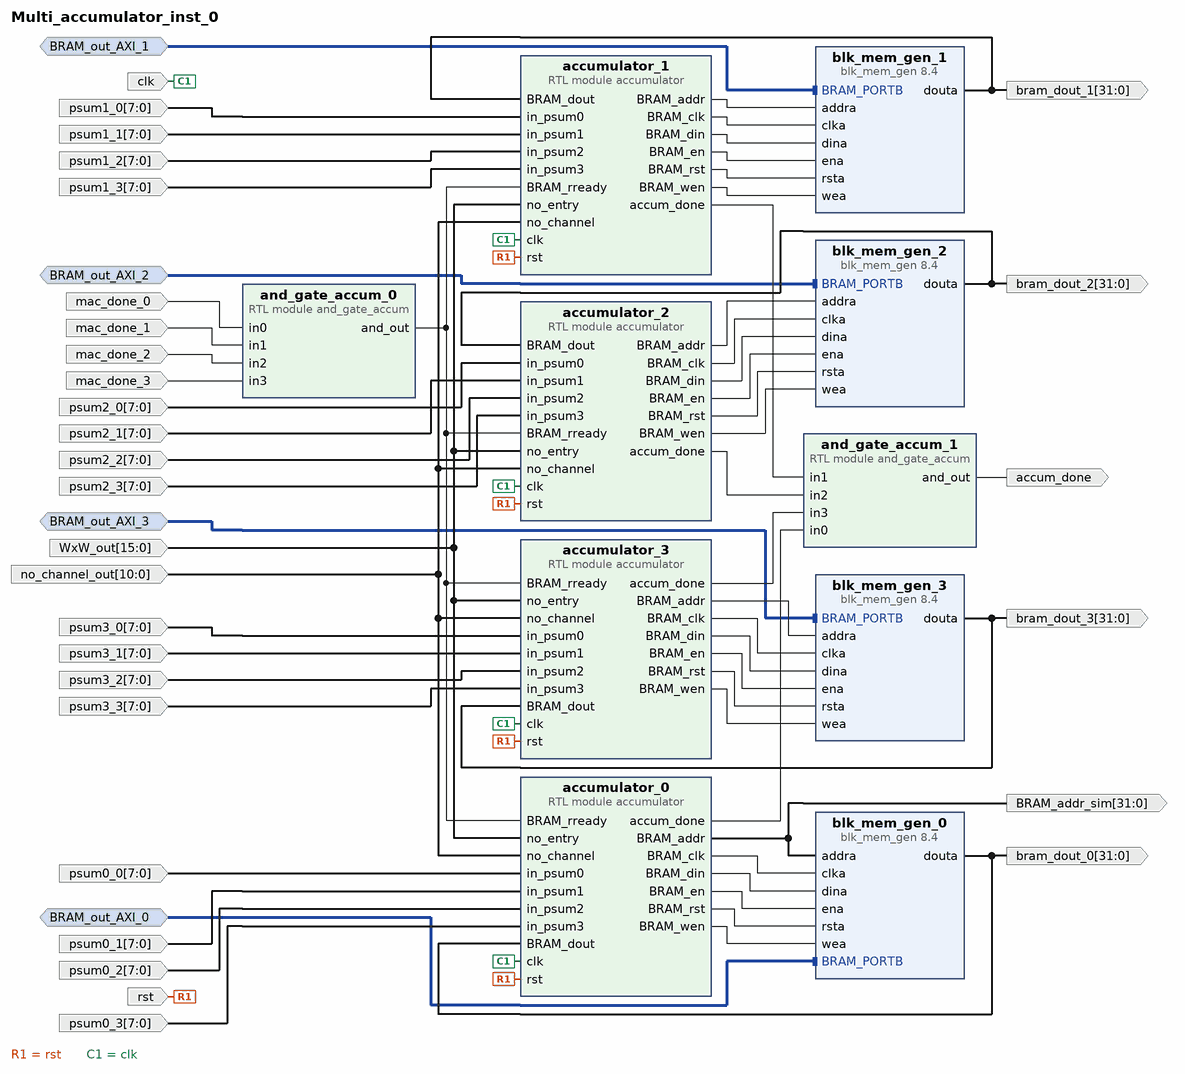
[diagram p0: block diagram of the top level]
# Vivado block design Multi_accumulator_inst_0, xc7z020clg400-1, Vivado 2021.1
create_bd_design Multi_accumulator_inst_0

create_bd_intf_port -mode Slave -vlnv xilinx.com:interface:bram_rtl:1.0 BRAM_out_AXI_0
create_bd_intf_port -mode Slave -vlnv xilinx.com:interface:bram_rtl:1.0 BRAM_out_AXI_1
create_bd_intf_port -mode Slave -vlnv xilinx.com:interface:bram_rtl:1.0 BRAM_out_AXI_2
create_bd_intf_port -mode Slave -vlnv xilinx.com:interface:bram_rtl:1.0 BRAM_out_AXI_3
create_bd_port -dir I -type clk clk
create_bd_port -dir I -from 7 -to 0 psum0_0
create_bd_port -dir I -from 7 -to 0 psum0_1
create_bd_port -dir I -from 7 -to 0 psum0_2
create_bd_port -dir I -from 7 -to 0 psum0_3
create_bd_port -dir I -from 7 -to 0 psum1_0
create_bd_port -dir I -from 7 -to 0 psum1_1
create_bd_port -dir I -from 7 -to 0 psum1_2
create_bd_port -dir I -from 7 -to 0 psum1_3
create_bd_port -dir I -from 7 -to 0 psum2_0
create_bd_port -dir I -from 7 -to 0 psum2_1
create_bd_port -dir I -from 7 -to 0 psum2_2
create_bd_port -dir I -from 7 -to 0 psum2_3
create_bd_port -dir I -from 7 -to 0 psum3_0
create_bd_port -dir I -from 7 -to 0 psum3_1
create_bd_port -dir I -from 7 -to 0 psum3_2
create_bd_port -dir I -from 7 -to 0 psum3_3
create_bd_port -dir I rst
create_bd_port -dir I mac_done_0
create_bd_port -dir I mac_done_1
create_bd_port -dir I mac_done_2
create_bd_port -dir I mac_done_3
create_bd_port -dir O accum_done
create_bd_port -dir I -from 15 -to 0 WxW_out
create_bd_port -dir I -from 10 -to 0 no_channel_out
create_bd_port -dir O -from 31 -to 0 bram_dout_0
create_bd_port -dir O -from 31 -to 0 bram_dout_1
create_bd_port -dir O -from 31 -to 0 bram_dout_2
create_bd_port -dir O -from 31 -to 0 bram_dout_3
create_bd_port -dir O -from 31 -to 0 BRAM_addr_sim

create_bd_cell -type ip -vlnv xilinx.com:ip:blk_mem_gen:8.4 blk_mem_gen_0
set_property -dict [list \
  CONFIG.Assume_Synchronous_Clk true \
  CONFIG.EN_SAFETY_CKT false \
  CONFIG.Enable_B Use_ENB_Pin \
  CONFIG.Memory_Type True_Dual_Port_RAM \
  CONFIG.Port_B_Clock 100 \
  CONFIG.Port_B_Enable_Rate 100 \
  CONFIG.Port_B_Write_Rate 50 \
  CONFIG.Use_RSTB_Pin true \
] [get_bd_cells blk_mem_gen_0]
create_bd_cell -type ip -vlnv xilinx.com:ip:blk_mem_gen:8.4 blk_mem_gen_2
set_property -dict [list \
  CONFIG.Assume_Synchronous_Clk true \
  CONFIG.EN_SAFETY_CKT false \
  CONFIG.Enable_B Use_ENB_Pin \
  CONFIG.Memory_Type True_Dual_Port_RAM \
  CONFIG.Port_B_Clock 100 \
  CONFIG.Port_B_Enable_Rate 100 \
  CONFIG.Port_B_Write_Rate 50 \
  CONFIG.Use_RSTB_Pin true \
] [get_bd_cells blk_mem_gen_2]
create_bd_cell -type ip -vlnv xilinx.com:ip:blk_mem_gen:8.4 blk_mem_gen_3
set_property -dict [list \
  CONFIG.Assume_Synchronous_Clk true \
  CONFIG.EN_SAFETY_CKT false \
  CONFIG.Enable_B Use_ENB_Pin \
  CONFIG.Memory_Type True_Dual_Port_RAM \
  CONFIG.Port_B_Clock 100 \
  CONFIG.Port_B_Enable_Rate 100 \
  CONFIG.Port_B_Write_Rate 50 \
  CONFIG.Use_RSTB_Pin true \
] [get_bd_cells blk_mem_gen_3]
create_bd_cell -type ip -vlnv xilinx.com:ip:blk_mem_gen:8.4 blk_mem_gen_1
set_property -dict [list \
  CONFIG.Assume_Synchronous_Clk true \
  CONFIG.EN_SAFETY_CKT false \
  CONFIG.Enable_B Use_ENB_Pin \
  CONFIG.Memory_Type True_Dual_Port_RAM \
  CONFIG.Port_B_Clock 100 \
  CONFIG.Port_B_Enable_Rate 100 \
  CONFIG.Port_B_Write_Rate 50 \
  CONFIG.Use_RSTB_Pin true \
] [get_bd_cells blk_mem_gen_1]
create_bd_cell -type module -reference and_gate_accum and_gate_accum_0
create_bd_cell -type module -reference and_gate_accum and_gate_accum_1
create_bd_cell -type module -reference accumulator accumulator_0
create_bd_cell -type module -reference accumulator accumulator_2
create_bd_cell -type module -reference accumulator accumulator_1
create_bd_cell -type module -reference accumulator accumulator_3

# ---- connections ----

connect_bd_intf_net -intf_net BRAM_PORTB_0_1 [get_bd_intf_ports BRAM_out_AXI_0] [get_bd_intf_pins blk_mem_gen_0/BRAM_PORTB]
connect_bd_intf_net -intf_net BRAM_PORTB_1_1 [get_bd_intf_ports BRAM_out_AXI_1] [get_bd_intf_pins blk_mem_gen_1/BRAM_PORTB]
connect_bd_intf_net -intf_net BRAM_PORTB_2_1 [get_bd_intf_ports BRAM_out_AXI_2] [get_bd_intf_pins blk_mem_gen_2/BRAM_PORTB]
connect_bd_intf_net -intf_net BRAM_PORTB_3_1 [get_bd_intf_ports BRAM_out_AXI_3] [get_bd_intf_pins blk_mem_gen_3/BRAM_PORTB]
connect_bd_net [get_bd_ports rst] \
  [get_bd_pins accumulator_0/rst] [get_bd_pins accumulator_2/rst] [get_bd_pins accumulator_1/rst] \
  [get_bd_pins accumulator_3/rst]
connect_bd_net [get_bd_ports WxW_out] \
  [get_bd_pins accumulator_0/no_entry] [get_bd_pins accumulator_2/no_entry] [get_bd_pins accumulator_1/no_entry] \
  [get_bd_pins accumulator_3/no_entry]
connect_bd_net [get_bd_ports no_channel_out] \
  [get_bd_pins accumulator_0/no_channel] [get_bd_pins accumulator_2/no_channel] [get_bd_pins accumulator_1/no_channel] \
  [get_bd_pins accumulator_3/no_channel]
connect_bd_net [get_bd_pins accumulator_0/BRAM_addr] [get_bd_pins blk_mem_gen_0/addra] [get_bd_ports BRAM_addr_sim]
connect_bd_net [get_bd_pins accumulator_0/BRAM_clk] [get_bd_pins blk_mem_gen_0/clka]
connect_bd_net [get_bd_pins accumulator_0/BRAM_din] [get_bd_pins blk_mem_gen_0/dina]
connect_bd_net [get_bd_pins accumulator_0/BRAM_en] [get_bd_pins blk_mem_gen_0/ena]
connect_bd_net [get_bd_pins accumulator_0/BRAM_rst] [get_bd_pins blk_mem_gen_0/rsta]
connect_bd_net [get_bd_pins accumulator_0/BRAM_wen] [get_bd_pins blk_mem_gen_0/wea]
connect_bd_net [get_bd_pins accumulator_0/accum_done] [get_bd_pins and_gate_accum_1/in0]
connect_bd_net -net accumulator_1_BRAM_addr [get_bd_pins accumulator_2/BRAM_addr] [get_bd_pins blk_mem_gen_2/addra]
connect_bd_net -net accumulator_1_BRAM_clk [get_bd_pins accumulator_2/BRAM_clk] [get_bd_pins blk_mem_gen_2/clka]
connect_bd_net -net accumulator_1_BRAM_din [get_bd_pins accumulator_2/BRAM_din] [get_bd_pins blk_mem_gen_2/dina]
connect_bd_net -net accumulator_1_BRAM_en [get_bd_pins accumulator_2/BRAM_en] [get_bd_pins blk_mem_gen_2/ena]
connect_bd_net -net accumulator_1_BRAM_rst [get_bd_pins accumulator_2/BRAM_rst] [get_bd_pins blk_mem_gen_2/rsta]
connect_bd_net -net accumulator_1_BRAM_wen [get_bd_pins accumulator_2/BRAM_wen] [get_bd_pins blk_mem_gen_2/wea]
connect_bd_net [get_bd_pins accumulator_1/accum_done] [get_bd_pins and_gate_accum_1/in1]
connect_bd_net -net accumulator_2_BRAM_addr [get_bd_pins accumulator_1/BRAM_addr] [get_bd_pins blk_mem_gen_1/addra]
connect_bd_net -net accumulator_2_BRAM_clk [get_bd_pins accumulator_1/BRAM_clk] [get_bd_pins blk_mem_gen_1/clka]
connect_bd_net -net accumulator_2_BRAM_din [get_bd_pins accumulator_1/BRAM_din] [get_bd_pins blk_mem_gen_1/dina]
connect_bd_net -net accumulator_2_BRAM_en [get_bd_pins accumulator_1/BRAM_en] [get_bd_pins blk_mem_gen_1/ena]
connect_bd_net -net accumulator_2_BRAM_rst [get_bd_pins accumulator_1/BRAM_rst] [get_bd_pins blk_mem_gen_1/rsta]
connect_bd_net -net accumulator_2_BRAM_wen [get_bd_pins accumulator_1/BRAM_wen] [get_bd_pins blk_mem_gen_1/wea]
connect_bd_net [get_bd_pins accumulator_2/accum_done] [get_bd_pins and_gate_accum_1/in2]
connect_bd_net [get_bd_pins accumulator_3/BRAM_addr] [get_bd_pins blk_mem_gen_3/addra]
connect_bd_net [get_bd_pins accumulator_3/BRAM_clk] [get_bd_pins blk_mem_gen_3/clka]
connect_bd_net [get_bd_pins accumulator_3/BRAM_din] [get_bd_pins blk_mem_gen_3/dina]
connect_bd_net [get_bd_pins accumulator_3/BRAM_en] [get_bd_pins blk_mem_gen_3/ena]
connect_bd_net [get_bd_pins accumulator_3/BRAM_rst] [get_bd_pins blk_mem_gen_3/rsta]
connect_bd_net [get_bd_pins accumulator_3/BRAM_wen] [get_bd_pins blk_mem_gen_3/wea]
connect_bd_net [get_bd_pins accumulator_3/accum_done] [get_bd_pins and_gate_accum_1/in3]
connect_bd_net -net and_gate_accum_0_out [get_bd_pins and_gate_accum_0/and_out] \
  [get_bd_pins accumulator_0/BRAM_rready] [get_bd_pins accumulator_2/BRAM_rready] [get_bd_pins accumulator_1/BRAM_rready] \
  [get_bd_pins accumulator_3/BRAM_rready]
connect_bd_net [get_bd_pins and_gate_accum_1/and_out] [get_bd_ports accum_done]
connect_bd_net [get_bd_pins blk_mem_gen_0/douta] [get_bd_ports bram_dout_0] [get_bd_pins accumulator_0/BRAM_dout]
connect_bd_net -net blk_mem_gen_1_douta [get_bd_pins blk_mem_gen_2/douta] [get_bd_ports bram_dout_2] [get_bd_pins accumulator_2/BRAM_dout]
connect_bd_net -net blk_mem_gen_2_douta [get_bd_pins blk_mem_gen_3/douta] [get_bd_ports bram_dout_3] [get_bd_pins accumulator_3/BRAM_dout]
connect_bd_net -net blk_mem_gen_3_douta [get_bd_pins blk_mem_gen_1/douta] [get_bd_ports bram_dout_1] [get_bd_pins accumulator_1/BRAM_dout]
connect_bd_net -net clk_0_1 [get_bd_ports clk] \
  [get_bd_pins accumulator_0/clk] [get_bd_pins accumulator_2/clk] [get_bd_pins accumulator_1/clk] \
  [get_bd_pins accumulator_3/clk]
connect_bd_net -net in0_0_1 [get_bd_ports mac_done_0] [get_bd_pins and_gate_accum_0/in0]
connect_bd_net -net in1_0_1 [get_bd_ports mac_done_1] [get_bd_pins and_gate_accum_0/in1]
connect_bd_net -net in2_0_1 [get_bd_ports mac_done_2] [get_bd_pins and_gate_accum_0/in2]
connect_bd_net -net in3_0_1 [get_bd_ports mac_done_3] [get_bd_pins and_gate_accum_0/in3]
connect_bd_net -net in_psum0_0_1 [get_bd_ports psum0_0] [get_bd_pins accumulator_0/in_psum0]
connect_bd_net -net in_psum0_1_1 [get_bd_ports psum1_0] [get_bd_pins accumulator_1/in_psum0]
connect_bd_net -net in_psum0_2_1 [get_bd_ports psum2_0] [get_bd_pins accumulator_2/in_psum0]
connect_bd_net -net in_psum0_3_1 [get_bd_ports psum3_0] [get_bd_pins accumulator_3/in_psum0]
connect_bd_net -net in_psum1_0_1 [get_bd_ports psum0_1] [get_bd_pins accumulator_0/in_psum1]
connect_bd_net -net in_psum1_1_1 [get_bd_ports psum1_1] [get_bd_pins accumulator_1/in_psum1]
connect_bd_net -net in_psum1_2_1 [get_bd_ports psum2_1] [get_bd_pins accumulator_2/in_psum1]
connect_bd_net -net in_psum1_3_1 [get_bd_ports psum3_1] [get_bd_pins accumulator_3/in_psum1]
connect_bd_net -net in_psum2_0_1 [get_bd_ports psum0_2] [get_bd_pins accumulator_0/in_psum2]
connect_bd_net -net in_psum2_1_1 [get_bd_ports psum1_2] [get_bd_pins accumulator_1/in_psum2]
connect_bd_net -net in_psum2_2_1 [get_bd_ports psum2_2] [get_bd_pins accumulator_2/in_psum2]
connect_bd_net -net in_psum2_3_1 [get_bd_ports psum3_2] [get_bd_pins accumulator_3/in_psum2]
connect_bd_net -net in_psum3_0_1 [get_bd_ports psum0_3] [get_bd_pins accumulator_0/in_psum3]
connect_bd_net -net in_psum3_1_1 [get_bd_ports psum1_3] [get_bd_pins accumulator_1/in_psum3]
connect_bd_net -net in_psum3_2_1 [get_bd_ports psum2_3] [get_bd_pins accumulator_2/in_psum3]
connect_bd_net -net in_psum3_3_1 [get_bd_ports psum3_3] [get_bd_pins accumulator_3/in_psum3]

validate_bd_design
save_bd_design
